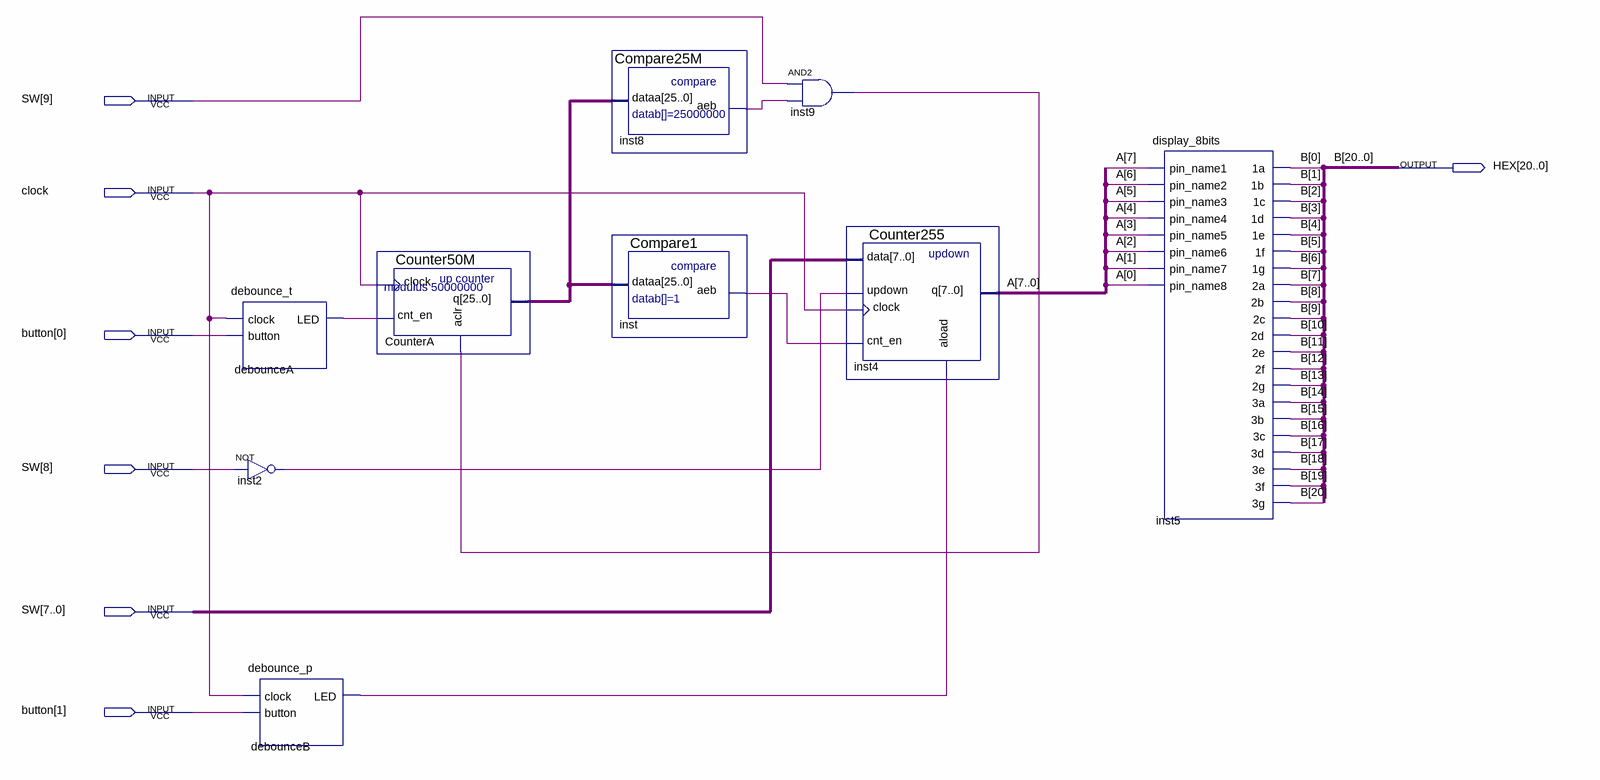
[diagram p0: schematic sheet]
// Quartus schematic CascadeCounters.bdf as structural Verilog: 9 symbols, 7 pins
module CascadeCounters (
  input  [9:0] SW,
  input  clock,
  input  [1:0] button,
  output [20:0] HEX
);

  wire debounceA_led, debounceB_led, inst2_out, inst8_aeb, inst9_out, inst_aeb;
  wire [7:0] A;
  wire [25:0] CounterA_q;

  debounce_t debounceA (.clock(clock), .button(button[0]), .LED(debounceA_led));
  not inst2 (inst2_out, SW[8]);
  debounce_p debounceB (.clock(clock), .button(button[1]), .LED(debounceB_led));
  Counter50M CounterA (.clock(clock), .cnt_en(debounceA_led), .aclr(inst9_out), .q(CounterA_q));
  Compare25M inst8 (.dataa(CounterA_q), .aeb(inst8_aeb));
  Compare1 inst (.dataa(CounterA_q), .aeb(inst_aeb));
  and inst9 (inst9_out, SW[9], inst8_aeb);
  Counter255 inst4 (.data(SW[7:0]), .updown(inst2_out), .clock(clock), .cnt_en(inst_aeb), .aload(debounceB_led), .q(A));
  display_8bits inst5 (
    .pin_name1(A[7]), .pin_name2(A[6]), .pin_name3(A[5]), .pin_name4(A[4]), .pin_name5(A[3]),
    .pin_name6(A[2]), .pin_name7(A[1]), .pin_name8(A[0]), .\1a (HEX[0]), .\1b (HEX[1]), .\1c (HEX[2]),
    .\1d (HEX[3]), .\1e (HEX[4]), .\1f (HEX[5]), .\1g (HEX[6]), .\2a (HEX[7]), .\2b (HEX[8]), .\2c (HEX[9]),
    .\2d (HEX[10]), .\2e (HEX[11]), .\2f (HEX[12]), .\2g (HEX[13]), .\3a (HEX[14]), .\3b (HEX[15]),
    .\3c (HEX[16]), .\3d (HEX[17]), .\3e (HEX[18]), .\3f (HEX[19]), .\3g (HEX[20]));

  // Other names for the same wires on the sheet: B[20:0] = HEX
endmodule
